# EAGLE design Solarladeregler (EAGLE 6.4)
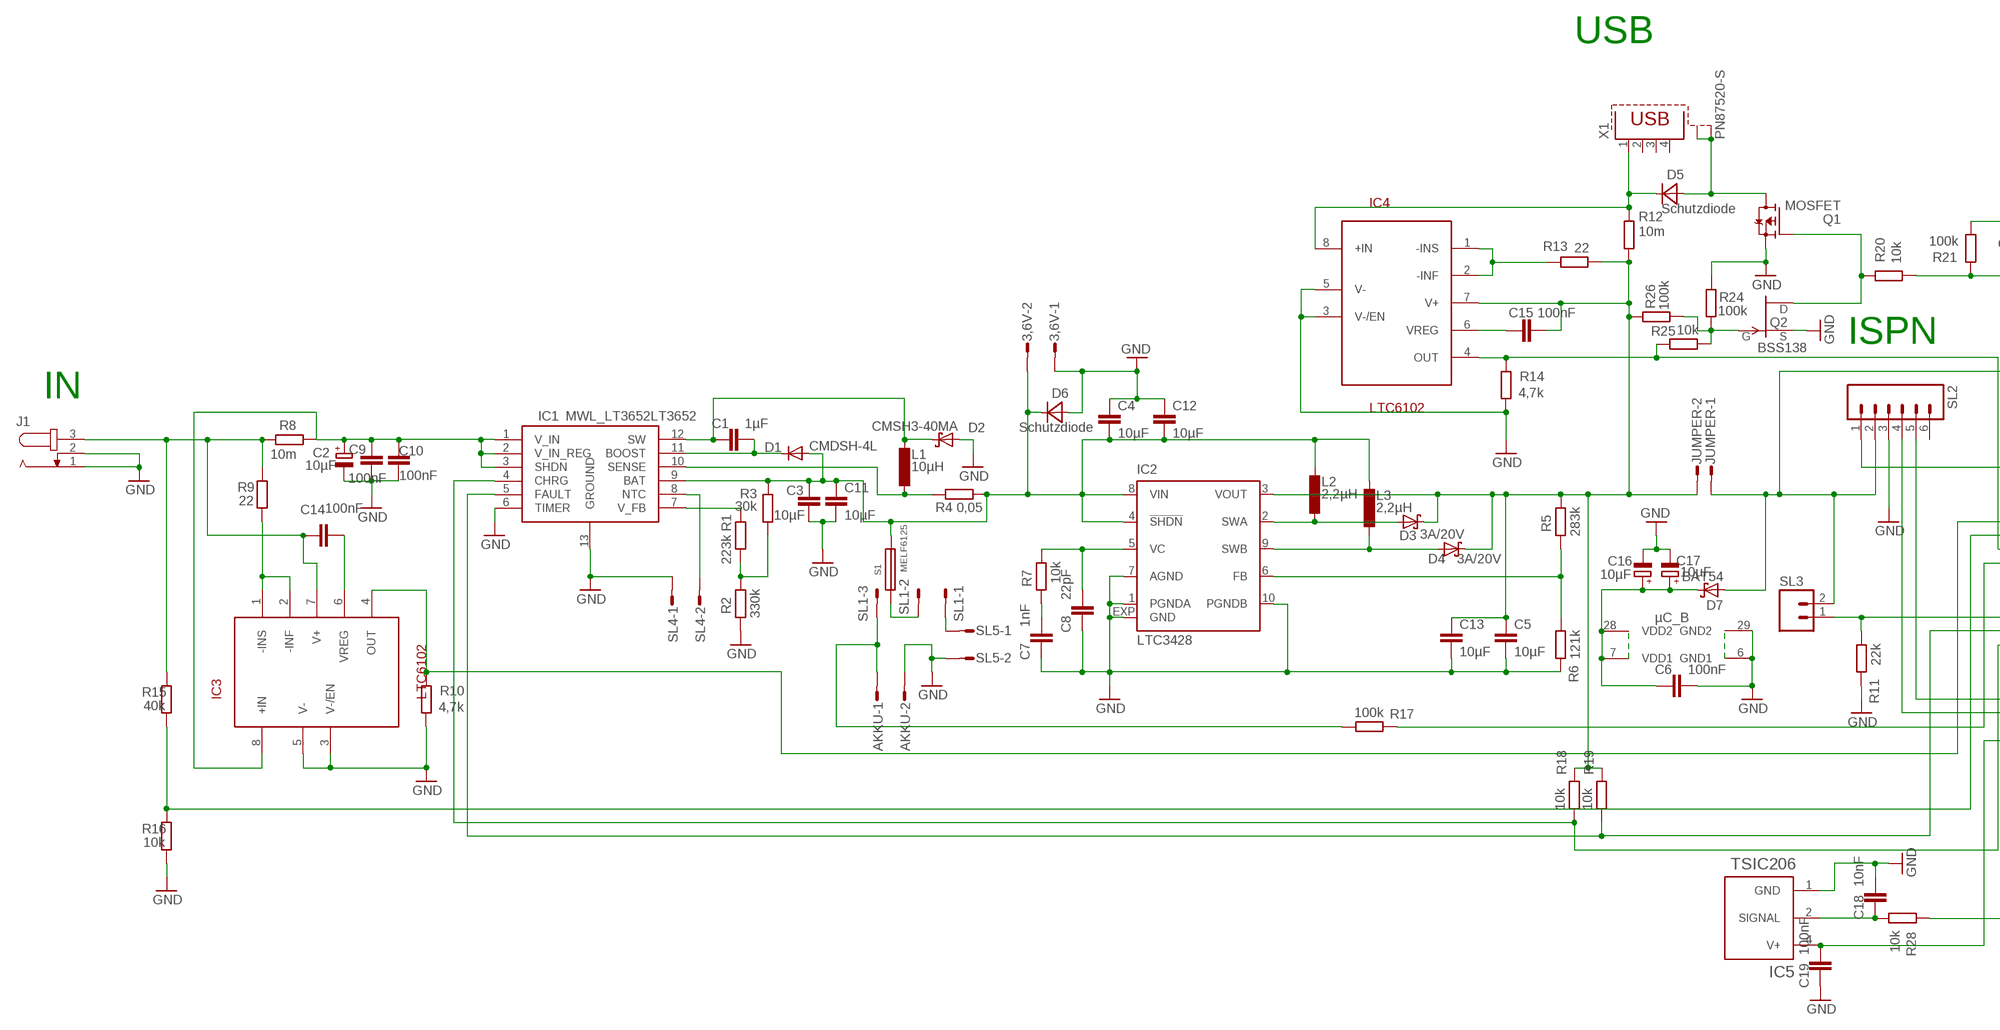
[diagram p0: schematic, sheet 1, part 1 of 2]
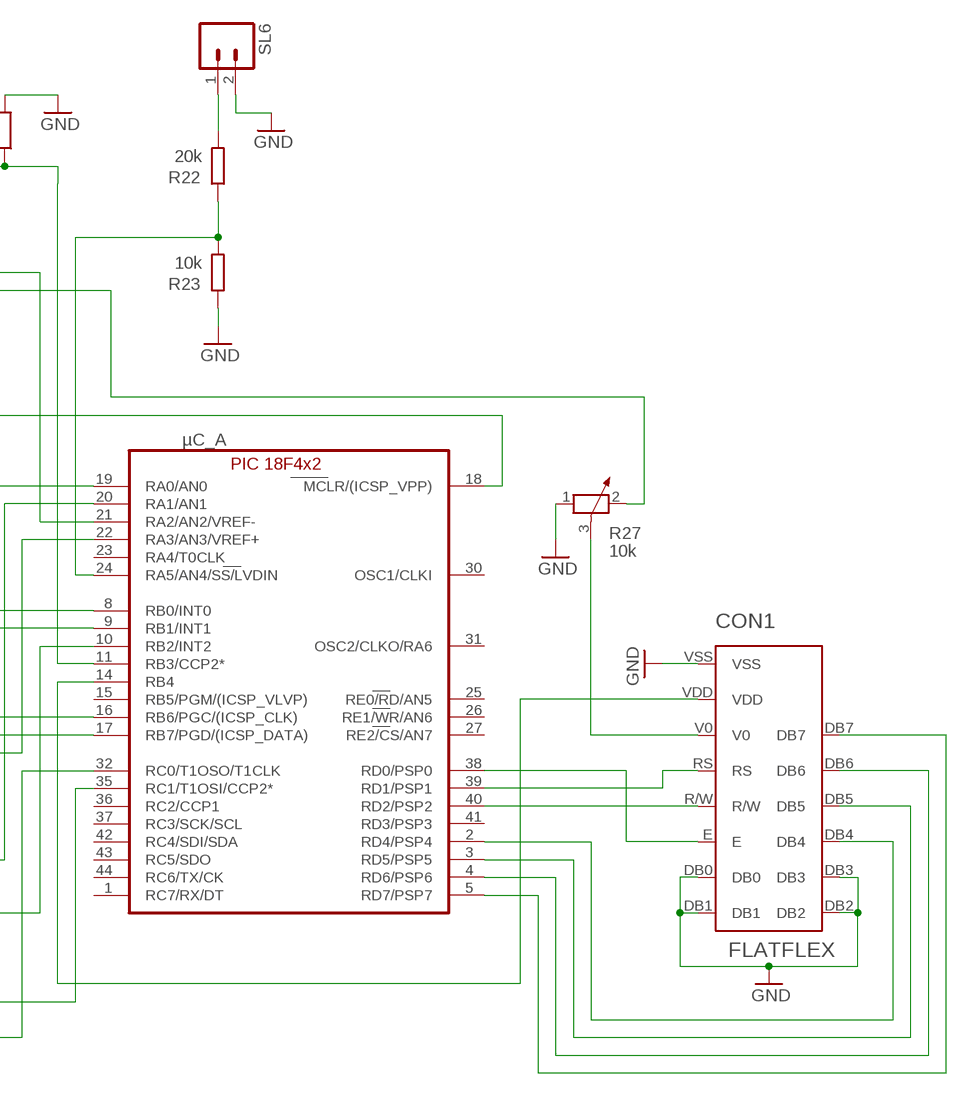
[diagram p1: schematic, sheet 1, part 2 of 2]

## Parts
3,6V  M02S  [02P]
AKKU  M02S  [02P]
C1  1µF  C-EUC0805  [C0805]
C2  10µF  CPOL-EU153CLV-0505  [153CLV-0505]
C3  10µF  C-EUC0805  [C0805]
C4  10µF  C-EUC0805  [C0805]
C5  10µF  C-EUC0805  [C0805]
C6  100nF  C-EUC0805  [C0805]
C7  1nF  C-EUC0805  [C0805]
C8  22pF  C-EUC0805  [C0805]
C9  100nF  C-EUC0805  [C0805]
C10  100nF  C-EUC0805  [C0805]
C11  10µF  C-EUC0805  [C0805]
C12  10µF  C-EUC0805  [C0805]
C13  10µF  C-EUC0805  [C0805]
C14  100nF  C-EUC0805  [C0805]
C15  100nF  C-EUC0805  [C0805]
C16  10µF  CPOL-EU153CLV-0505  [153CLV-0505]
C17  10µF  CPOL-EU153CLV-0505  [153CLV-0505]
C18  10nF  C-EUC0805  [C0805]
C19  100nF  C-EUC0805  [C0805]
CON1  FLATFLEX  [FLATFLEX]
D1  CMDSH-4L  MBR0520LT  [SOD123]
D2  CMSH3-40MA  SCHOTTKY-DIODESMD  [SMB]
D3  3A/20V  MBRS320T3  [SMC]
D4  3A/20V  MBRS320T3  [SMC]
D5  Schutzdiode  MBRA340T3  [SMA]
D6  Schutzdiode  MBRA340T3  [SMA]
D7  BAT54  [SOT23]
IC1  MWL_LT3652LT3652  [DFN12DD3X3]
IC2  LTC3428  [DFN10-3X3]
IC3  LTC6102  [MSOP8]
IC4  LTC6102  [MSOP8]
IC5  TSIC206  [SO08]
J1  JACK-PLUG0  [SPC4077]
JUMPER  M02S  [02P]
L1  10µH  L-EUWE-TPC  [POWER-CHOKE_WE-TPC]
L2  2,2µH  L-EUWE-TPC  [POWER-CHOKE_WE-TPC]
L3  2,2µH  L-EUWE-TPC  [POWER-CHOKE_WE-TPC]
Q1  MOSFET  FDD4141TO252  [TO252]
Q2  BSS138  SST5484  [SOT23]
R1  223k  R-EU_R0805  [R0805]
R2  330k  R-EU_R0805  [R0805]
R3  30k  R-EU_R0805  [R0805]
R4  0,05  R-EU_R0805  [R0805]
R5  283k  R-EU_R0805  [R0805]
R6  121k  R-EU_R0805  [R0805]
R7  10k  R-EU_R0805  [R0805]
R8  10m  R-EU_R2512  [R2512]
R9  22  R-EU_R0805  [R0805]
R10  4,7k  R-EU_R0805  [R0805]
R11  22k  R-EU_R0805  [R0805]
R12  10m  R-EU_R2512  [R2512]
R13  22  R-EU_R0805  [R0805]
R14  4,7k  R-EU_R0805  [R0805]
R15  40k  R-EU_R0805  [R0805]
R16  10k  R-EU_R0805  [R0805]
R17  100k  R-EU_R0805  [R0805]
R18  10k  R-EU_R0805  [R0805]
R19  10k  R-EU_R0805  [R0805]
R20  10k  R-EU_R0805  [R0805]
R21  100k  R-EU_R0805  [R0805]
R22  20k  R-EU_R0805  [R0805]
R23  10k  R-EU_R0805  [R0805]
R24  100k  R-EU_R0805  [R0805]
R25  10k  R-EU_R0805  [R0805]
R26  100k  R-EU_R0805  [R0805]
R27  10k  POTENTIOMETER_PT-10  [PT-10]
R28  10k  R-EU_R0805  [R0805]
S1  MELF6125  [MELF6125]
SL1  M03S  [03P]
SL2  M06  [06P]
SL3  M02  [02P]
SL4  M02S  [02P]
SL5  M02S  [02P]
SL6  M02  [02P]
X1  PN87520-S  [PN87520-S]
µC  PIC18F4X2TQFP44  [TQFP44]

## Nets
GND: 3,6V.1 AKKU.2 C2.- C3.2 C4.1 C5.2 C6.1 C7.2 C8.2 C9.2 C10.2 C11.2 C12.1 C13.2 C16.- C17.- C18.1 C19.2 CON1.DB0 CON1.DB1 CON1.DB2 CON1.DB3 CON1.VSS D2.A D6.A IC1.6(TIMER) IC1.13(GROUND) IC2.1(PGNDA) IC2.7(AGND) IC2.10(PGNDB) IC2.EXP(GND) IC3.3(V-/EN) IC3.5(V-) IC4.3(V-/EN) IC4.5(V-) IC5.1(GND) J1.1 J1.2 Q1.2(S) Q2.2(S) R2.2 R6.2 R10.2 R11.2 R14.2 R16.2 R21.2 R23.1 R24.1 R27.1 SL2.3 SL4.1 SL5.2 SL6.2 µC.6(_B:GND1) µC.29(_B:GND2)
N$1: CON1.E µC.38(_A:RD0/PSP0)
N$2: C1.1 D1.C IC1.11(BOOST)
N$3: C2.+ C9.1 C10.1 IC1.1(V_IN) IC1.2(V_IN_REG) IC1.3(SHDN) IC3.8(+IN) R8.1
N$4: IC1.10(SENSE) L1.1 R4.2
N$5: IC1.8(NTC) SL4.2
N$6: R1.2 R2.1 R3.1
N$7: C1.2 D2.C IC1.12(SW) L1.2
N$8: 3,6V.2 C3.1 C4.2 C11.1 C12.2 D1.A D6.C IC1.9(BAT) IC2.4(!SHDN) IC2.8(VIN) L2.2 L3.2 R3.2 R4.1 S1.P$4
N$9: C5.1 C13.1 C15.2 D3.C D4.C IC2.3(VOUT) IC4.7(V+) JUMPER.2 R5.1 R12.2 R13.2 R18.2 R19.2 R26.1
N$10: D7.1(A) JUMPER.1 R27.2 SL2.2 SL3.2
N$11: D3.A IC2.2(SWA) L2.1
N$12: C8.1 IC2.5(VC) R7.1
N$13: D4.A IC2.9(SWB) L3.1
N$14: IC2.6(FB) R5.2 R6.1
N$15: C7.1 R7.2
N$16: SL2.4 µC.17(_A:RB7/PGD/(ICSP_DATA))
N$17: SL2.1 µC.18(_A:MCLR/(ICSP_VPP))
N$18: SL2.5 µC.16(_A:RB6/PGC/(ICSP_CLK))
N$19: IC3.1(-INS) IC3.2(-INF) R9.2
N$20: C14.2 IC3.6(VREG)
N$21: IC3.4(OUT) R10.1 µC.19(_A:RA0/AN0)
N$22: D5.C IC4.8(+IN) R12.1 X1.1
N$23: R11.1 SL3.1 µC.8(_A:RB0/INT0)
N$24: IC4.1(-INS) IC4.2(-INF) R13.1
N$25: C15.1 IC4.6(VREG)
N$26: IC4.4(OUT) R14.1 R25.1 µC.21(_A:RA2/AN2/VREF-)
N$27: R15.2 R16.1 µC.20(_A:RA1/AN1)
N$28: IC1.7(V_FB) R1.1
N$29: R17.2 µC.22(_A:RA3/AN3/VREF+)
N$30: AKKU.1 R17.1 SL1.3
N$31: D5.A Q1.3(D) X1.S1 X1.S2
N$32: SL1.1 SL5.1
N$33: IC1.4(CHRG) R18.1 µC.10(_A:RB2/INT2)
N$34: IC1.5(FAULT) R19.1 µC.9(_A:RB1/INT1)
N$35: R20.2 R21.1 µC.11(_A:RB3/CCP2*)
N$36: Q1.1(G) Q2.1(D) R20.1
N$37: R22.2 SL6.1
N$38: S1.P$3 SL1.2
N$39: R22.1 R23.2 µC.24(_A:RA5/AN4/SS/LVDIN)
N$40: Q2.3(G) R24.2 R25.2 R26.2
N$41: C6.2 C16.+ C17.+ D7.3(C) µC.7(_B:VDD1) µC.28(_B:VDD2)
N$42: C14.1 IC3.7(V+) J1.3 R8.2 R9.1 R15.1
N$43: CON1.RS µC.39(_A:RD1/PSP1)
N$44: CON1.R/W µC.40(_A:RD2/PSP2)
N$45: CON1.DB4 µC.2(_A:RD4/PSP4)
N$46: CON1.DB5 µC.3(_A:RD5/PSP5)
N$47: CON1.DB6 µC.4(_A:RD6/PSP6)
N$48: CON1.DB7 µC.5(_A:RD7/PSP7)
N$49: CON1.V0 R27.3
N$50: R28.1 µC.35(_A:RC1/T1OSI/CCP2*)
N$51: CON1.VDD µC.14(_A:RB4)
N$52: C19.1 IC5.4(V+) µC.32(_A:RC0/T1OSO/T1CLK)
N$53: C18.2 IC5.2(SIGNAL) R28.2
Unconnected: SL2.6 X1.2 X1.3 X1.4 µC.1(_A:RC7/RX/DT) µC.15(_A:RB5/PGM/(ICSP_VLVP)) µC.23(_A:RA4/T0CLK) µC.25(_A:RE0/RD/AN5) µC.26(_A:RE1/WR/AN6) µC.27(_A:RE2/CS/AN7) µC.36(_A:RC2/CCP1) µC.37(_A:RC3/SCK/SCL) µC.41(_A:RD3/PSP3) µC.42(_A:RC4/SDI/SDA) µC.43(_A:RC5/SDO) µC.44(_A:RC6/TX/CK)

## Notes on the sheet
- USB
- ISPN
- IN

## Power pins joined to a net without a drawn wire
OSC1/CLKI: µC.30(_A:OSC1/CLKI)
OSC2/CLKO/RA6: µC.31(_A:OSC2/CLKO/RA6)

## Library data of the parts
3,6V AKKU JUMPER SL4 SL5 = con-amp-quick:M02S: AMP QUICK CONNECTOR; OC_FARNELL: unknown; OC_NEWARK: unknown
C1 C3-C15 C18 C19 = rcl:C-EU: CAPACITOR, European symbol
C2 C16 C17 = rcl:CPOL-EU: POLARIZED CAPACITOR, European symbol
CON1 = flatflex:FLATFLEX
D1 = diode:MBR0520LT: SCHOTTKY BARRIER RECTIFIER Source: http://onsemi.com .. MBR0520LT1-D.pdf
D2 = diode:SCHOTTKY-DIODE: Schottky Diode
D3 D4 = diode:MBRS3*0T3: SCHOTTKY BARRIER RECTIFIER 3.0 AMPERES 20, 30, 40 VOLT Source: MBRS340T3-D.pdf
D5 D6 = diode:MBRA340T3: Surface Mount Schottky Power Rectifier Source: http://www.onsemi.com/pub_link/Collateral/MBRA340T3-D.PDF
D7 = diode:BAT54: Schottky Diodes Source: Fairchild .. BAT54.pdf
IC1 = MWL_LT3652:MWL_LT3652
IC2 = linear-technology:LTC3428: LTC3428 4A,2Mhz Dual Phase Step-Up DC/DC Converter
IC3 IC4 = linear-technology:LTC6102
IC5 = linear:TSIC206
J1 = con-jack:JACK-PLUG: DC POWER JACK Power Jack, DC, Right Angle, Through Hole, Rated 5A at 16VDC, PC Terminals Distributor: Farnell (www.Farnell.de) Drawing: 84N1161.pdf / 84N1162.pdf Manufacturer: SPC Technology (www.spctechnology.com) Type: SPC4077 / SPC 4078; OC_FARNELL: unknown; OC_NEWARK: unknown
L1-L3 = rcl:L-EU: INDUCTOR, European symbol
Q1 = transistor-fet:FDD4141: P-Channel PowerTrench® MOSFET Source: FDD4141.pdf
Q2 = transistor-fet:?548*: N-Channel JFETs Source: VISHAY 2N5484.pdf Compatible: TO92 2N5245 J304 J305 U310 J308 J309 J310 TO72 2N4416 2N4416A 2N3823 2N4351 3N169 3N170 3N171 MFE3002 TO18 2N3796 2N3797 MFE825 Source: Motorola European Master Guide Pacge 3-59
R1-R26 R28 = rcl:R-EU_: RESISTOR, European symbol
R27 = rcl:POTENTIOMETER_: Potentiometer
S1 = fuse_Melf:MELF6125
SL1 = con-amp-quick:M03S: AMP QUICK CONNECTOR; OC_FARNELL: unknown; OC_NEWARK: unknown
SL2 = con-amp-quick:M06: AMP QUICK CONNECTOR; OC_FARNELL: unknown; OC_NEWARK: unknown
SL3 SL6 = con-amp-quick:M02: AMP QUICK CONNECTOR; OC_FARNELL: unknown; OC_NEWARK: unknown
X1 = con-berg:PN87520-S; OC_FARNELL: unknown; OC_NEWARK: unknown
µC = pic18f4x2:PIC18F4X2: Pic Microcontroller

## Board
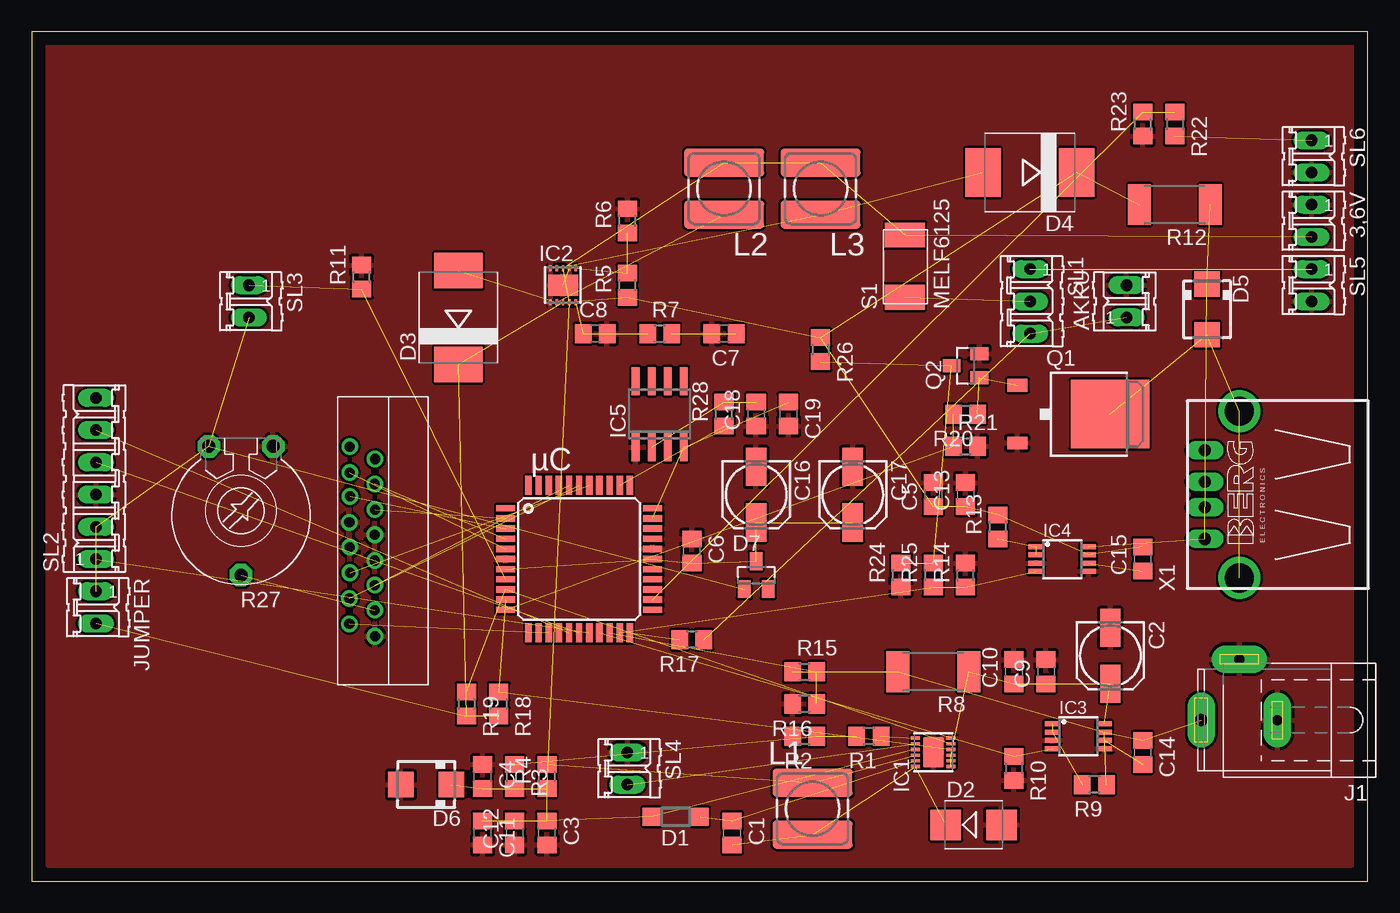
[diagram p2: board, top side]

Size 105.39 x 66.98 mm. Coordinates in mm from the lower left corner, seen from the top.
Outline: 0,0 105.39,0 105.39,66.98 0,66.98 0,0
Copper layers (1*16): Top 0.035mm / dielectric 1.5mm / Bottom 0.035mm
Design rules "default": minimum track width 10mil, minimum drill 24mil, track to track 8mil, track to pad 8mil, pad to pad 8mil, via to via 8mil, smd to smd 8mil, copper to edge 40mil, drill to drill 8mil, minimum pad ring 10mil, minimum via ring 8mil, stop-mask expansion 4mil, vias tented up to drill 0mil, thermal gap 10mil

### Footprints (pad centres in the part's own frame; a part is rotated, then mirrored left to right if it is on the bottom)
02P = drill 0.914 long: 1 -1.27,0; 2 1.27,0
C0805 = smd 1.3 x 1.5: 1 -0.95,0; 2 0.95,0
153CLV-0505 = smd 3 x 1.6: + 2.2,0; - -2.2,0
FLATFLEX = drill 0.8: DB0 -12.81,-2.929; DB1 -10.784,-2.929; DB2 -11.758,-0.952; DB3 -9.809,-0.926; DB4 -8.809,-2.954; DB5 -7.757,-0.978; DB6 -6.782,-2.929; DB7 -5.885,-0.952; E -13.784,-0.978; P$8 -4.808,-2.954; P$16 -3.833,-0.952; R/W -14.759,-2.929; RS -15.811,-0.926; V0 -16.734,-2.929; VDD -17.811,-0.926; VSS -18.786,-2.954
SOD123 = smd 1.4 x 1.4: A 1.9,0; C -1.9,0
SMB = smd 2.4 x 2.4: A 2.2,0; C -2.2,0
SMC = smd 2.8 x 3.8: A 3.7,0; C -3.7,0
SMA = smd 2 x 2: A 2,0; C -2,0
SOT23 = smd 1 x 1.4: 1 -0.95,-1.1; 2 0.95,-1.1; 3 0,1.1
DFN12DD3X3 = smd 0.25 x 0.7: 1 -1.125,-1.4; 2 -0.675,-1.4; 3 -0.225,-1.4; 4 0.225,-1.4; 5 0.675,-1.4; 6 1.125,-1.4; 7 1.125,1.4; 8 0.675,1.4; 9 0.225,1.4; 10 -0.225,1.4; 11 -0.675,1.4; 12 -1.125,1.4 | smd 2.38 x 1.65: 13 0,0
DFN10-3X3 = smd 0.25 x 0.45: 1 -1,-1.35; 2 -0.5,-1.35; 3 0,-1.35; 4 0.5,-1.35; 5 1,-1.35; 6 1,1.35; 7 0.5,1.35; 8 0,1.35; 9 -0.5,1.35; 10 -1,1.35 | smd 2.38 x 1.65: EXP 0,0
MSOP8 = smd 0.4 x 1.2: 1 -0.975,-2.05; 2 -0.325,-2.05; 3 0.325,-2.05; 4 0.975,-2.05; 5 0.975,2.05; 6 0.325,2.05; 7 -0.325,2.05; 8 -0.975,2.05
SO08 = smd 0.6 x 2.2: 1 -1.905,-2.6; 2 -0.635,-2.6; 3 0.635,-2.6; 4 1.905,-2.6; 5 1.905,2.6; 6 0.635,2.6; 7 -0.635,2.6; 8 -1.905,2.6
SPC4077 = drill 0.8 pad 2.184 long: 1 -3,0; 2 0,-4.8 | drill 1 pad 2.184 long: 3 3,0
POWER-CHOKE_WE-TPC = smd 6.3 x 2.2: 1 0,2.05; 2 0,-2.05
TO252 = smd 1 x 1.6: 1 -2.28,-4.8; 2 2.28,-4.8 | smd 5.4 x 6.2: 3 0,2.5
R0805 = smd 1.3 x 1.5: 1 -0.95,0; 2 0.95,0
R2512 = smd 1.8 x 3.2: 1 -2.8,0; 2 2.8,0
PT-10 = drill 1.016 pad 1.778 octagon: 1 -2.54,-5.08; 2 2.54,-5.08; 3 0,5.08
MELF6125 = smd 1.96 x 3.15: P$3 -2.205,-0.3; P$4 2.691,-0.316
03P = drill 0.914 long: 1 -2.54,0; 2 0,0; 3 2.54,0
06P = drill 0.914 long: 1 -6.35,0; 2 -3.81,0; 3 -1.27,0; 4 1.27,0; 5 3.81,0; 6 6.35,0
PN87520-S = drill 0.95 long: 1 -3.5,2.71; 2 -1,2.71; 3 1,2.71; 4 3.5,2.71 | drill 2.3 pad 2.9: S1 -6.57,0; S2 6.57,0
TQFP44 = smd 1.5 x 0.5: 1 -5.8,4; 2 -5.8,3.2; 3 -5.8,2.4; 4 -5.8,1.6; 5 -5.8,0.8; 6 -5.8,0; 7 -5.8,-0.8; 8 -5.8,-1.6; 9 -5.8,-2.4; 10 -5.8,-3.2; 11 -5.8,-4; 23 5.8,-4; 24 5.8,-3.2; 25 5.8,-2.4; 26 5.8,-1.6; 27 5.8,-0.8; 28 5.8,0; 29 5.8,0.8; 30 5.8,1.6; 31 5.8,2.4; 32 5.8,3.2; 33 5.8,4 | smd 0.5 x 1.5: 12 -4,-5.8; 13 -3.2,-5.8; 14 -2.4,-5.8; 15 -1.6,-5.8; 16 -0.8,-5.8; 17 0,-5.8; 18 0.8,-5.8; 19 1.6,-5.8; 20 2.4,-5.8; 21 3.2,-5.8; 22 4,-5.8; 34 4,5.8; 35 3.2,5.8; 36 2.4,5.8; 37 1.6,5.8; 38 0.8,5.8; 39 0,5.8; 40 -0.8,5.8; 41 -1.6,5.8; 42 -2.4,5.8; 43 -3.2,5.8; 44 -4,5.8

### Placement (x,y rotation side)
3,6V  100.97,52.07 270 top
AKKU  86.36,45.72 90 top
C1  55.24,3.81 270 top
C2  85.09,17.78 270 top
C3  40.64,3.81 270 top
C4  35.56,8.26 270 top
C5  71.12,30.48 90 top
C6  52.07,26.04 270 top
C7  54.61,43.18 180 top
C8  44.45,43.18 0 top
C9  80.01,16.51 90 top
C10  77.47,16.51 90 top
C11  35.56,3.81 270 top
C12  38.1,3.81 90 top
C13  73.66,30.48 90 top
C14  87.63,10.16 270 top
C15  87.63,25.4 90 top
C16  57.15,30.48 270 top
C17  64.77,30.48 270 top
C18  57.15,36.83 90 top
C19  59.69,36.83 270 top
CON1  24.13,38.1 90 top
D1  50.8,5.08 180 top
D2  74.3,4.45 0 top
D3  33.66,44.45 90 top
D4  78.74,55.88 180 top
D5  92.71,45.09 270 top
D6  31.11,7.62 180 top
D7  57.15,24.13 0 top
IC1  71.12,10.16 90 top
IC2  41.91,46.99 0 top
IC3  82.55,11.43 270 top
IC4  81.28,25.4 270 top
IC5  49.53,36.83 0 top
J1  95.25,12.7 180 top
JUMPER  5.08,21.59 270 top
L1  61.59,5.71 0 top
L2  54.61,54.61 180 top
L3  62.23,54.61 180 top
Q1  82.55,36.83 270 top
Q2  73.66,40.64 90 top
R1  66.04,11.43 180 top
R2  60.96,11.43 180 top
R3  38.1,8.26 270 top
R4  40.64,8.26 90 top
R5  46.99,46.99 90 top
R6  46.99,52.07 90 top
R7  49.53,43.18 0 top
R8  71.12,16.51 180 top
R9  83.82,7.62 180 top
R10  77.47,8.89 270 top
R11  26.04,47.62 90 top
R12  90.17,53.34 180 top
R13  76.2,27.94 90 top
R14  73.66,24.13 90 top
R15  60.96,16.51 0 top
R16  60.96,13.97 180 top
R17  52.07,19.05 180 top
R18  36.83,13.97 270 top
R19  34.29,13.97 270 top
R20  73.66,36.83 180 top
R21  73.66,34.29 0 top
R22  90.17,59.69 270 top
R23  87.63,59.69 90 top
R24  68.58,24.13 90 top
R25  71.12,24.13 90 top
R26  62.23,41.91 270 top
R27  16.51,29.21 180 top
R28  54.61,36.83 90 top
S1  68.58,48.26 90 top
SL1  78.74,45.72 270 top
SL2  5.08,31.75 90 top
SL3  17.14,45.72 270 top
SL4  46.99,8.89 270 top
SL5  100.97,46.99 270 top
SL6  100.97,57.15 270 top
X1  95.25,30.48 90 top
µC  43.18,25.4 0 top

### Tracks (layer width: path | path; a pad name or v marks a point on that pad's centre or on a via)
GND  (1 unrouted)
  pour Top: 1.27,1.27 104.14,1.27 104.14,66.04 1.27,66.04
N$1  (1 unrouted)
N$2  (2 unrouted)
N$3  (7 unrouted)
N$4  (2 unrouted)
N$5  (1 unrouted)
N$6  (2 unrouted)
N$7  (3 unrouted)
N$8  (14 unrouted)
N$9  (13 unrouted)
N$10  (4 unrouted)
N$11  (2 unrouted)
N$12  (2 unrouted)
N$13  (2 unrouted)
N$14  (2 unrouted)
N$15  (1 unrouted)
N$16  (1 unrouted)
N$17  (1 unrouted)
N$18  (1 unrouted)
N$19  (2 unrouted)
N$20  (1 unrouted)
N$21  (2 unrouted)
N$22  (3 unrouted)
N$23  (2 unrouted)
N$24  (2 unrouted)
N$25  (1 unrouted)
N$26  (3 unrouted)
N$27  (2 unrouted)
N$28  (1 unrouted)
N$29  (1 unrouted)
N$30  (2 unrouted)
N$31  (3 unrouted)
N$32  (1 unrouted)
N$33  (2 unrouted)
N$34  (2 unrouted)
N$35  (2 unrouted)
N$36  (2 unrouted)
N$37  (1 unrouted)
N$38  (1 unrouted)
N$39  (2 unrouted)
N$40  (3 unrouted)
N$41  (5 unrouted)
N$42  (5 unrouted)
N$43  (1 unrouted)
N$44  (1 unrouted)
N$45  (1 unrouted)
N$46  (1 unrouted)
N$47  (1 unrouted)
N$48  (1 unrouted)
N$49  (1 unrouted)
N$50  (1 unrouted)
N$51  (1 unrouted)
N$52  (2 unrouted)
N$53  (2 unrouted)